# EasyEDA Pro project STM32F103C8T6_C6T6核心板.eprj, board PCB4_视频里绘制的_未验证
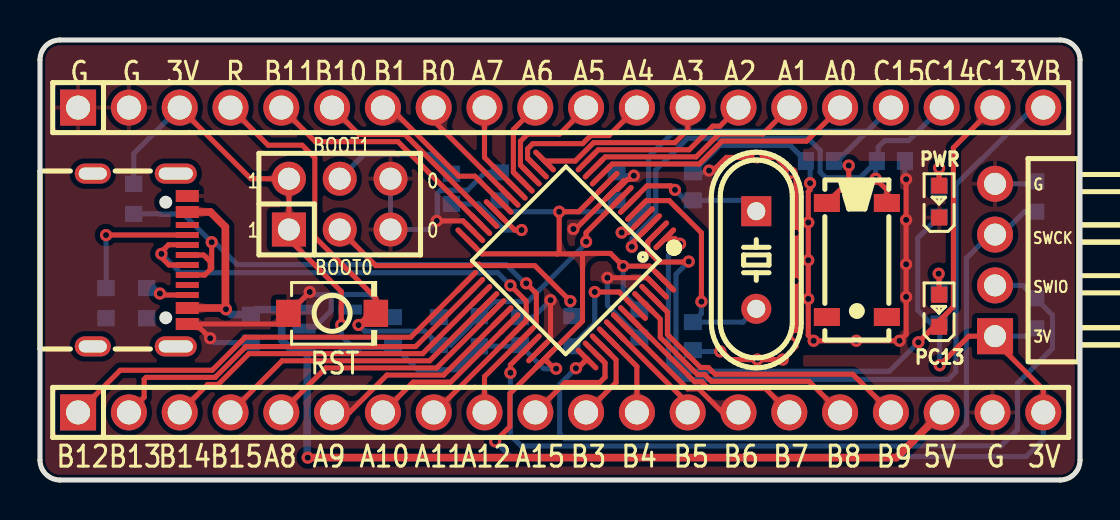
[diagram p10: board, top side]
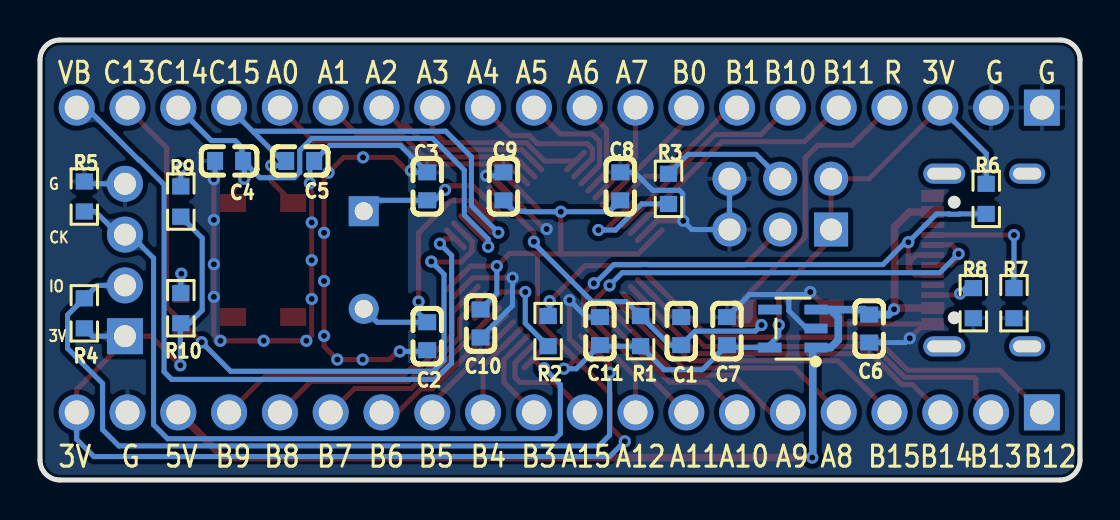
[diagram p11: board, bottom side, seen from below]

Outline 52 x 22 mm; copper layers: Top Layer, Bottom Layer. Coordinates in mm from the lower left corner of the outline.
Outline path: 0,21 0,1 arc(0.29,0.29) 1,0 51,0 arc(51.71,0.29) 52,1 52,21 arc(51.71,21.71) 51,22 1,22 arc(0.29,21.71) 0,21
Stack: Top Layer 0.035mm / Dielectric1 1.51mm FR4 er 4.5 / Bottom Layer 0.035mm

## Design rules (mm)
template: JLCPCB Capability(Two Layers Board)
spacing copperThickness1oz (default): track to track 0.102, other pairs 0.152 to 0.3
spacing copperThickness2oz: track to track 0.203, other pairs 0.152 to 0.3
track width copperThickness1oz (default): min 0.127, default 0.254, max 2.54
track width copperThickness2oz: min 0.203, default 0.254, max 2.54
differential pair differentialPair (default): width min 0.127, default 0.254, max 2.54; gap min 0.152, default 0.152
via viaSize (default): diameter min 0.5, default 0.61, max 10; hole min 0.3, default 0.305, max 6.3

## Placement (name value [footprint] x y rotation side)
C1  1uF  [C0603]  19.94 7.44 270 bottom
C2  30pF  [C0603]  32.64 7.19 270 bottom
C3  30pF  [C0603]  32.64 14.68 90 bottom
C4  10pF  [C0603]  42.54 15.95 0 bottom
C5  10pF  [C0603]  38.99 15.95 180 bottom
C6  1uF  [C0603]  10.54 7.57 90 bottom
C7  1uF  [C0603]  17.65 7.44 270 bottom
C8  100nF  [C0603]  22.99 14.68 90 bottom
C9  100nF  [C0603]  28.83 14.68 90 bottom
C10  100nF  [C0603]  29.97 7.83 270 bottom
C11  100nF  [C0603]  24 7.44 90 bottom
H1  PZ254V-12-6P  [HDR-TH_6P-P2.54-V-M-R2-C3-S2.54]  14.99 13.79 0 top
H2  PZ254R-11-04P  [HDR-TH_4P-P2.54-H-M-W10.4]  47.75 11 90 top
J1  2.54-1*20P直针  [HDR-TH_20P-P2.54-V-M-1]  26.03 3.38 0 top
J2  2.54-1*20P直针  [HDR-TH_20P-P2.54-V-M-1]  26.03 18.62 0 top
LDO1  ME6211C33M5G-N  [SOT-23-5_L3.0-W1.7-P0.95-LS2.8-BL]  14.35 7.57 90 bottom
PC13  LTST-C190KSKT  [LED0603-RD]  44.96 8.46 90 top
PWR  LTST-C190KSKT  [LED0603-RD]  44.96 13.92 90 top
R1  10kΩ  [R0603]  21.97 7.44 270 bottom
R2  100kΩ  [R0603]  26.59 7.44 270 bottom
R3  100kΩ  [R0603]  20.57 14.56 90 bottom
R4  10kΩ  [R0603]  49.78 8.33 90 bottom
R5  10kΩ  [R0603]  49.78 14.17 90 bottom
R6  1.5kΩ  [R0603]  4.69 14.06 270 bottom
R7  5.1kΩ  [R0603]  3.3 8.84 90 bottom
R8  5.1kΩ  [R0603]  5.33 8.84 90 bottom
R9  510Ω  [R0603]  44.96 13.92 90 bottom
R10  510Ω  [R0603]  44.96 8.59 90 bottom
SW1  TS-1088-AR02016  [SW-SMD_L3.9-W3.0-P4.45]  14.6 8.33 0 top
U1  STM32F103C8T6  [LQFP-48_L7.0-W7.0-P0.50-LS9.0-BL]  26.29 11 135 top
U2  32.768kHz  [MC-306_4P-L8.0-W3.2-P5.5-BL]  40.84 11 270 top
USB1  TYPE-C16PIN  [USB-C-SMD_TYPE-C16PIN]  5 11 270 top
X2  8MHz  [HC-49US_L11.5-W4.5-P4.88]  35.81 11 270 top

## Footprints (pads in the part's own frame, mm; a bottom-side part is the same pattern mirrored in y, then rotated)
C0603
  rect 0.8x0.9 smd: 1(-0.7,0) 2(0.7,0)
HC-49US_L11.5-W4.5-P4.88
  rect 1.5x1.5 hole 0.9: 1(-2.44,0)
  round 1.5 hole 0.9: 2(2.44,0)
HDR-TH_4P-P2.54-H-M-W10.4
  rect 1.8x1.8 hole 1.1: 1(-3.81,0)
  round 1.8 hole 1.1: 2(-1.27,0) 3(1.27,0) 4(3.81,0)
HDR-TH_6P-P2.54-V-M-R2-C3-S2.54
  rect 1.7x1.7 hole 1.1: 1(-2.54,-1.27)
  round 1.7 hole 1.1: 2(-2.54,1.27) 3(0,-1.27) 4(0,1.27) 5(2.54,-1.27) 6(2.54,1.27)
HDR-TH_20P-P2.54-V-M-1
  rect 1.8x1.8 hole 1.2: 1(-24.13,0)
  round 1.8 hole 1.2: 2(-21.59,0) 3(-19.05,0) 4(-16.51,0) 5(-13.97,0) 6(-11.43,0) 7(-8.89,0) 8(-6.35,0) 9(-3.81,0) 10(-1.27,0) 11(1.27,0) 12(3.81,0) 13(6.35,0) 14(8.89,0) 15(11.43,0) 16(13.97,0) 17(16.51,0) 18(19.05,0) 19(21.59,0) 20(24.13,0)
LED0603-RD
  rect 0.8x0.8 smd: 1(-0.799,0) 2(0.799,0)
LQFP-48_L7.0-W7.0-P0.50-LS9.0-BL
  oval 0.27x1.5 smd: 1(-2.75,-4.25) 2(-2.25,-4.25) 3(-1.75,-4.25) 4(-1.25,-4.25) 5(-0.75,-4.25) 6(-0.25,-4.25) 7(0.25,-4.25) 8(0.75,-4.25) 9(1.25,-4.25) 10(1.75,-4.25) 11(2.25,-4.25) 12(2.75,-4.25) 25(2.75,4.25) 26(2.25,4.25) 27(1.75,4.25) 28(1.25,4.25) 29(0.75,4.25) 30(0.25,4.25) 31(-0.25,4.25) 32(-0.75,4.25) 33(-1.25,4.25) 34(-1.75,4.25) 35(-2.25,4.25) 36(-2.75,4.25)
  oval 1.5x0.27 smd: 13(4.25,-2.75) 14(4.25,-2.25) 15(4.25,-1.75) 16(4.25,-1.25) 17(4.25,-0.75) 18(4.25,-0.25) 19(4.25,0.25) 20(4.25,0.75) 21(4.25,1.25) 22(4.25,1.75) 23(4.25,2.25) 24(4.25,2.75) 37(-4.25,2.75) 38(-4.25,2.25) 39(-4.25,1.75) 40(-4.25,1.25) 41(-4.25,0.75) 42(-4.25,0.25) 43(-4.25,-0.25) 44(-4.25,-0.75) 45(-4.25,-1.25) 46(-4.25,-1.75) 47(-4.25,-2.25) 48(-4.25,-2.75)
MC-306_4P-L8.0-W3.2-P5.5-BL
  rect 0.9x1.3 smd: 1(-2.85,-1.5) 2(2.85,-1.5) 3(2.85,1.5) 4(-2.85,1.5)
R0603
  rect 0.806x0.864 smd: 1(-0.753,0) 2(0.753,0)
SOT-23-5_L3.0-W1.7-P0.95-LS2.8-BL
  rect 0.49x1.157 smd: 1(-0.95,-1.153) 2(0,-1.153) 3(0.95,-1.153)
  rect 0.49x1.175 smd: 4(0.95,1.153) 5(-0.95,1.153)
SW-SMD_L3.9-W3.0-P4.45
  rect 1.23x1.36 smd: 1(-2.185,0) 2(2.185,0)
USB-C-SMD_TYPE-C16PIN
  oval 1x2.1 hole 0.6x1.7: 1(-4.32,1.788) 2(4.32,1.788)
  oval 1x1.8 hole 0.6x1.4: 3(-4.32,-2.362) 4(4.32,-2.362)
  rect 0.6x1.15 smd: A1B12(-3.2,2.362) A4B9(-2.4,2.362) B1A12(3.2,2.362) B4A9(2.4,2.362)
  rect 0.3x1.15 smd: A5(-1.25,2.362) A6(-0.25,2.362) A7(0.25,2.362) A8(1.25,2.362) B5(1.75,2.362) B6(0.75,2.362) B7(-0.75,2.362) B8(-1.75,2.362)

## Nets
As in the schematic, except:
GND: C1.1 C2.2 C3.2 C4.2 C5.2 C6.1 C7.1 C8.2 C9.2 C10.2 C11.2 H1.5 H1.6 H2.4 J1.19 J2.1 J2.2 LDO1.2 PWR.1 R5.2 R7.1 R8.1 SW1.1 U1.8 U1.23 U1.35 U1.47 USB1.A1B12 USB1.B1A12
PC13: J2.19 PC13.1 U1.2
$1N1807: PWR.2 R9.2
$1N3751: PC13.2 R10.2

Pads without a net: LDO1 4; U2 2 3; USB1 1 2 3 4 A8 B8

## Via types
v1: diameter 0.61, hole 0.305, Top Layer to Bottom Layer, 59 vias

## Routing (per net, layer and track width the routed paths; a pad name or vN(x,y) marks a point on that pad's centre or on a via; arc(x,y) is an arc through that point)
3V3: length 118.4
  Top Layer w0.254: 25.86,11.31 25.96,11.41 v1(25.96,13.41) 26.93,13.41 28.41,14.89 ; 25.86,11.31 22.09,11.31 U1.24 ; 25.86,11.31 27.17,11.31 ; v1(15.06,7.75) 15.06,9.42 12.45,12.04 H1.1 H1.2 10.54,15.06 J2.3 ; v1(44.98,5.74) 46.44,7.19 47.5,7.19 ; 27.17,11.31 27.2,11.33 28.52,11.33 v1(29.16,10.69) 30.48,10.69 U1.48 ; 27.17,11.31 27.13,11.26 27.13,7.95 U1.36 ; J1.20 50.16,4.53 47.5,7.19 ; v1(25.81,5.56) 25.71,5.56 U1.36 ; v1(22.76,1.93) 23.5,2.67 23.5,4.32 U1.36 ; 47.5,7.19 H2.1
  Bottom Layer w0.254: C10.1 29.16,9.34 v1(29.16,10.69) ; C8.1 23.56,13.41 v1(25.96,13.41) 27.72,13.41 27.75,13.44 28.28,13.44 C9.1 ; v1(44.98,5.74) 44.98,7.81 R10.1 44.54,7.83 43.89,8.49 43.89,12.1 R9.1 ; v1(25.81,5.56) 25.18,5.56 C11.1 23.95,6.69 R1.2 20.79,5.51 18.88,5.51 17.78,6.62 LDO1.5 15.5,6.77 15.06,7.22 v1(15.06,7.75) ; v1(22.76,1.93) 23.52,1.17 49.3,1.17 50.16,2.03 J1.20 ; H2.1 49.39,7.19 R4.1 ; J2.3 4.69,16.33 R6.1
5V: length 53.5
  Top Layer w0.381: J1.18 42.82,1.12 v1(13.39,1.12) ; USB1.A4B9 8.52,13.4 9.27,12.65 9.27,8.56 ; USB1.B4A9 9.23,8.6 9.27,8.56 ; 9.27,8.56 v1(9.3,8.54)
  Bottom Layer w0.381: v1(13.39,1.12) 13.36,1.14 13.36,6.46 LDO1.1 12.47,6.62 12.09,7 12.09,8.14 12.47,8.52 ; v1(9.3,8.54) 9.56,8.27 C6.2 10.79,8.52 12.47,8.52 ; 12.47,8.52 LDO1.3
GND: length 96.9
  Top Layer w0.254: v1(38.5,14.84) 38.5,14.51 38.41,14.42 v1(38.41,12.87) v1(38.41,10.99) v1(38.41,9.05) 38.41,7.23 v1(38.68,6.96) v1(40.81,6.96) v1(42.98,6.96) 43.31,7.29 v1(43.31,9.15) v1(43.31,10.79) v1(43.31,13) v1(43.31,15.04) ; 7.8,7.8 11.89,7.8 SW1.1 v1(13.49,9.4) ; 7.8,7.8 USB1.B1A12 ; 7.8,7.8 v1(8.51,7.09) ; 30.88,9.59 30.36,10.11 v1(28.37,10.11) ; v1(29.69,15.22) 29.51,15.03 29.38,15.03 28.89,14.54 U1.8 26.78,12.55 v1(26.67,12.55) ; v1(34.01,6.43) 34.11,6.43 34.52,6.02 v1(35.87,6.02) v1(37.13,6.02) 37.8,6.68 v1(37.8,7.21) v1(37.8,9.95) v1(37.8,12.36) 37.8,15.14 v1(37.57,15.37) 36.81,16.13 v1(35.85,16.13) 34.32,16.13 33.66,15.47 v1(33.45,15.47) ; v1(19.84,12.96) 21.15,12.96 U1.23 ; v1(25.53,8.99) 25.53,7.06 24.88,6.4
  Bottom Layer w0.254: C7.1 16.52,9.27 14.55,9.27 ; C8.2 22.26,15.38 21.37,14.48 20.03,14.48 19.86,14.32 19.86,12.98 v1(19.84,12.96) 19.41,12.52 H1.5 H1.6 ; v1(33.45,15.47) 33.36,15.38 C3.2 33.99,16.73 37.51,16.73 38.5,15.74 v1(38.5,14.84) ; v1(29.69,15.22) 29,15.22 C9.2 ; v1(28.37,10.11) 28.37,8.72 C10.2 ; v1(43.31,15.04) 43.25,15.1 C4.2 ; 47.5,14.81 49.67,14.81 R5.2 ; v1(8.51,7.09) 8.73,6.87 C6.1 ; C11.2 24.68,8.14 v1(25.53,8.99) ; v1(34.01,6.43) 32.7,6.43 C2.2 ; LDO1.2 13.66,7.57 14.55,8.46 14.55,9.27 ; 14.55,9.27 13.62,9.27 v1(13.49,9.4)
BOOT0: length 5.6
  Top Layer w0.254: v1(27.74,9.4) 28.95,9.4 29.82,8.53
  Bottom Layer w0.254: R2.2 27.74,7.83 v1(27.74,9.4)
BOOT1: length 5.8
  Top Layer w0.254: v1(24.08,12.5) 23.73,12.5 22.75,13.47
  Bottom Layer w0.254: v1(24.08,12.5) 23.23,12.5 21.92,13.8 R3.1
D+: length 33.2
  Top Layer w0.254: J1.9 22.22,5.17 24.17,7.11 24.82,7.76 24.82,9.33 v1(24.31,9.83) ; 8.51,10.52 8.59,10.59 v1(8.59,11.89) ; 8.51,10.52 8.51,10.92 8.18,11.25 USB1.A6 ; 8.51,10.52 8.24,10.25 USB1.B6
  Bottom Layer w0.254: R6.2 6.02,13.3 6.04,13.29 6.54,13.29 6.56,13.3 7.17,13.3 v1(8.59,11.89) 8.74,11.89 9.85,10.77 23.31,10.77 24.24,9.83 v1(24.31,9.83)
D-: length 29.9
  Top Layer w0.254: v1(23.52,9.73) 24.31,8.94 24.31,7.96 U1.32 19.73,3.38 J1.8 ; USB1.B7 7.35,11.76 6.43,11.76 6.12,11.46 6.12,11.08 6.45,10.75 USB1.A7
  Bottom Layer w0.254: v1(23.52,9.73) 22.89,10.36 7.01,10.36 v1(6.07,11.31)
OSC32_IN: length 26.7
  Top Layer w0.254: U2.4 42.34,14.5 v1(41.78,15.06) ; v1(29.59,11.66) 29.59,11.83 U1.3
  Bottom Layer w0.254: 41.91,16.33 41.78,16.2 41.78,15.89 ; 41.91,16.33 41.91,16.02 C4.1 ; 41.91,16.33 41.91,16.64 42.24,16.97 43.43,16.97 J2.18 ; v1(41.78,15.06) 41.78,15.89 ; 41.78,15.89 41.01,15.11 39.28,15.11 39.01,15.39 39.01,16.48 38.4,17.08 32.37,17.08 30.78,15.5 30.78,13.25 29.59,12.05 v1(29.59,11.66)
OSC32_OUT: length 24.3
  Top Layer w0.254: v1(29.08,12.37) 29.43,12.37 U1.4 ; U2.1 40.44,14.94 v1(40.44,15.72)
  Bottom Layer w0.254: 41.3,17.38 41.24,17.44 31.71,17.44 30.43,16.16 30.43,13.72 v1(29.08,12.37) ; 41.3,17.38 39.88,15.95 C5.1 39.92,15.72 v1(40.44,15.72) ; 41.3,17.38 J2.17
OSC_IN: length 12.2
  Top Layer w0.254: 29.82,13.47 30.32,13.97 31.46,13.97 33.07,12.36 v1(33.07,8.92)
  Bottom Layer w0.254: X2.2 35.14,7.89 C2.1 33.07,8.32 v1(33.07,8.92)
OSC_OUT: length 7.2
  Top Layer w0.254: 29.47,13.83 30.35,14.71 31.55,14.71 v1(31.75,14.5)
  Bottom Layer w0.254: v1(31.75,14.5) 32.27,13.98 C3.1 35.27,13.98 X2.1
PA0: length 13.3
  Top Layer w0.254: U1.10 28.61,15.8 32.96,15.8 34.1,16.94 38.33,16.94 J2.16
PA1: length 11
  Top Layer w0.254: U1.11 28.26,16.16 32.81,16.16 33.95,17.3 36.14,17.3 J2.15
PA2: length 8.7
  Top Layer w0.254: J2.14 34,17.69 33.64,17.69 32.46,16.51 27.91,16.51 U1.12
PA3: length 8.9
  Top Layer w0.254: U1.13 26.76,15.95 27.68,16.87 31.75,16.87 32.38,17.5 J2.13
PA4: length 7.5
  Top Layer w0.254: 24.88,15.6 24.87,15.6 24.38,16.08 24.38,16.56 24.64,16.82 27.13,16.82 27.53,17.22 28.45,17.22 J2.12
PA5: length 5.9
  Top Layer w0.254: U1.15 24.02,15.74 24.02,16.94 24.38,17.3 25.98,17.3 J2.11
PA6: length 4.4
  Top Layer w0.254: J2.10 23.67,17.52 23.67,15.39 24.17,14.89
PA7: length 4.7
  Top Layer w0.254: U1.17 22.22,16.12 J2.9
PA8: length 12.8
  Top Layer w0.254: J1.5 14.29,5.6 19.83,5.6 22.75,8.53
PA9: length 10.5
  Top Layer w0.254: U1.30 20.18,5.25 17.34,5.25 15.48,3.38 J1.6
PA10: length 8.2
  Top Layer w0.254: J1.7 18.66,4.89 20.53,4.89 U1.31
PA13: length 40.8
  Top Layer w0.254: v1(23.52,5.36) 23.52,5.76 U1.34
  Bottom Layer w0.254: v1(23.52,5.36) 23.52,2.24 24.05,1.7 48.06,1.7 48.87,2.52 48.87,4.83 50.62,6.58 50.62,8.25 R4.2 49.14,9.73 H2.2
PA14: length 37.8
  Top Layer w0.254: v1(26.8,5.59) 26.89,5.59 U1.37
  Bottom Layer w0.254: v1(26.8,5.59) 25.98,4.78 25.98,2.31 26.24,2.06 45.62,2.06 46.32,2.76 46.32,11.09 47.5,12.27 48.08,12.27 49.23,13.42 R5.1
PA15: length 5.7
  Top Layer w0.254: J1.10 26.26,4.88 27.99,4.88 28.25,5.14 28.25,5.86 U1.38
PB0: length 6
  Top Layer w0.254: J2.8 19.69,17.96 U1.18
PB1: length 7.9
  Top Layer w0.254: U1.19 21.74,15.19 20.93,15.19 17.5,18.62 J2.7
PB3: length 4.3
  Top Layer w0.254: J1.11 28.8,4.88 28.8,6.01 U1.39
PB4: length 4.3
  Top Layer w0.254: 28.41,7.11 29.84,5.68 J1.12
PB5: length 5.6
  Top Layer w0.254: J1.13 32.38,3.84 U1.41
PB6: length 7.6
  Top Layer w0.254: U1.42 32.38,4.56 32.94,4.56 34.12,3.38 J1.14
PB7: length 10
  Top Layer w0.254: 29.47,8.17 32.73,4.92 33.09,4.92 33.43,4.57 36.27,4.57 J1.15
PB8: length 12.6
  Top Layer w0.254: U1.45 31.01,8.04 31.01,7.13 32.88,5.27 33.23,5.27 33.58,4.93 38.46,4.93 J1.16
PB9: length 15.1
  Top Layer w0.254: J1.17 40.64,5.29 33.76,5.29 33.41,5.63 33.02,5.63 31.37,7.28 31.37,8.39 U1.46
PB10: length 10.1
  Top Layer w0.254: J2.6 15.95,17.27 18.25,17.27 U1.21
PB11: length 12.4
  Top Layer w0.254: U1.22 17.9,16.92 13.77,16.92 J2.5
PB12: length 22.2
  Top Layer w0.254: U1.25 18.54,7.14 10.26,7.14 8.61,5.49 4.01,5.49 J1.1
PB13: length 20.3
  Top Layer w0.254: U1.26 18.78,6.67 10.3,6.67 8.76,5.13 5.31,5.13 5.21,5.03 5.21,4.14 J1.2
PB14: length 17.5
  Top Layer w0.254: J1.3 8.38,4.78 8.91,4.78 10.44,6.32 19.13,6.32 U1.27
PB15: length 15.2
  Top Layer w0.254: U1.28 19.48,5.96 12.1,5.96 J1.4
PC13: length 35
  Top Layer w0.254: v1(32.44,10.92) 32.41,10.9 30.95,10.9 30.39,11.45 30.39,11.92 30.88,12.41 ; v1(43.92,6.89) 44.69,7.66 PC13.1 44.96,7.95 45.67,8.66 45.67,16.61 47.62,18.57 J2.19
  Bottom Layer w0.254: v1(32.44,10.92) 31.8,10.29 31.8,5.97 32.33,5.44 42.47,5.44 v1(43.92,6.89)
RST: length 32.4
  Top Layer w0.254: v1(15.93,7.75) 16.51,8.33 SW1.2 16.79,9.09 13.74,12.14 13.74,16.11 13.11,16.74 11.4,16.74 J2.4 ; U1.7 27.31,12.37 v1(27.31,11.91)
  Bottom Layer w0.254: v1(15.93,7.75) 16.23,7.44 19.24,7.44 C1.2 20.52,6.74 R1.1 22.69,8.92 24.38,8.92 27.31,11.84 v1(27.31,11.91)
VB: length 37.3
  Top Layer w0.254: v1(32,11.81) 31.76,12.06 U1.1
  Bottom Layer w0.254: v1(32,11.81) 31.42,11.23 31.42,5.85 32.24,5.03 45.41,5.03 45.8,5.41 45.8,14.77 47.01,15.99 47.05,15.99 49.68,18.62 J2.20
$1N626: length 13.8
  Top Layer w0.254: H1.3 16.79,10.72 21.53,10.72 21.6,10.79 21.95,10.79 22.01,10.72 24.74,10.72 v1(26.52,8.94)
  Bottom Layer w0.254: v1(26.52,8.94) 26.52,8.27 R2.1
$1N630: length 6.5
  Bottom Layer w0.254: R3.2 19.6,16.28 16.21,16.28 H1.4
$1N1267: length 6.7
  Top Layer w0.254: USB1.A5 3.31,12.25 v1(3.3,12.24)
  Bottom Layer w0.254: R7.2 v1(3.3,12.24)
$1N1316: length 2.2
  Top Layer w0.254: v1(5.99,9.32) 6.07,9.25 USB1.B5
  Bottom Layer w0.254: v1(5.99,9.32) 5.72,9.59 R8.2
$1N1807: length 1.8
  Top Layer w0.254: PWR.2 v1(44.96,15.6)
  Bottom Layer w0.254: v1(44.96,15.6) R9.2
$1N3751: length 2
  Top Layer w0.254: v1(44.93,10.31) 44.96,10.29 PC13.2
  Bottom Layer w0.254: v1(44.93,10.31) 44.96,10.29 R10.2

## Copper pours and planes (outline as drawn; the poured copper is in the pictures)
GND on Top Layer: -2.26,23.8 57.58,23.8 57.58,-4.16 -2.26,-4.16
GND on Bottom Layer: -3.15,23.89 59.55,23.89 59.55,-6.72 -3.15,-6.72

Small or netless copper shapes (teardrops, artwork), in the pictures only: 99 on Top Layer, 110 on Bottom Layer

## Text on the board
Bottom Silkscreen Layer: CK | G | IO | 3V | B12 | B13 | B14 | R | B15 | B11 | A8 | A9 | B10 | B1 | A10 | B0 | A11 | A7 | A12 | A6 | A15 | B3 | A5 | B4 | A4 | B5 | A3 | B6 | A2 | A1 | B7 | A0 | B8 | B9 | C15 | 5V | C14 | C13 | VB
Top Silkscreen Layer: SWCK | G | SWIO | 3V | 1 | BOOT1 | BOOT0 | 0 | B12 | B13 | B14 | B15 | R | B11 | A8 | RST | A9 | B10 | A10 | B1 | A11 | B0 | A12 | A7 | A15 | A6 | B3 | A5 | A4 | B4 | A3 | B5 | A2 | B6 | B7 | A1 | A0 | B8 | C15 | B9 | C14 | 5V | C13 | VB
